# EAGLE design M896X (EAGLE 6.6.0)
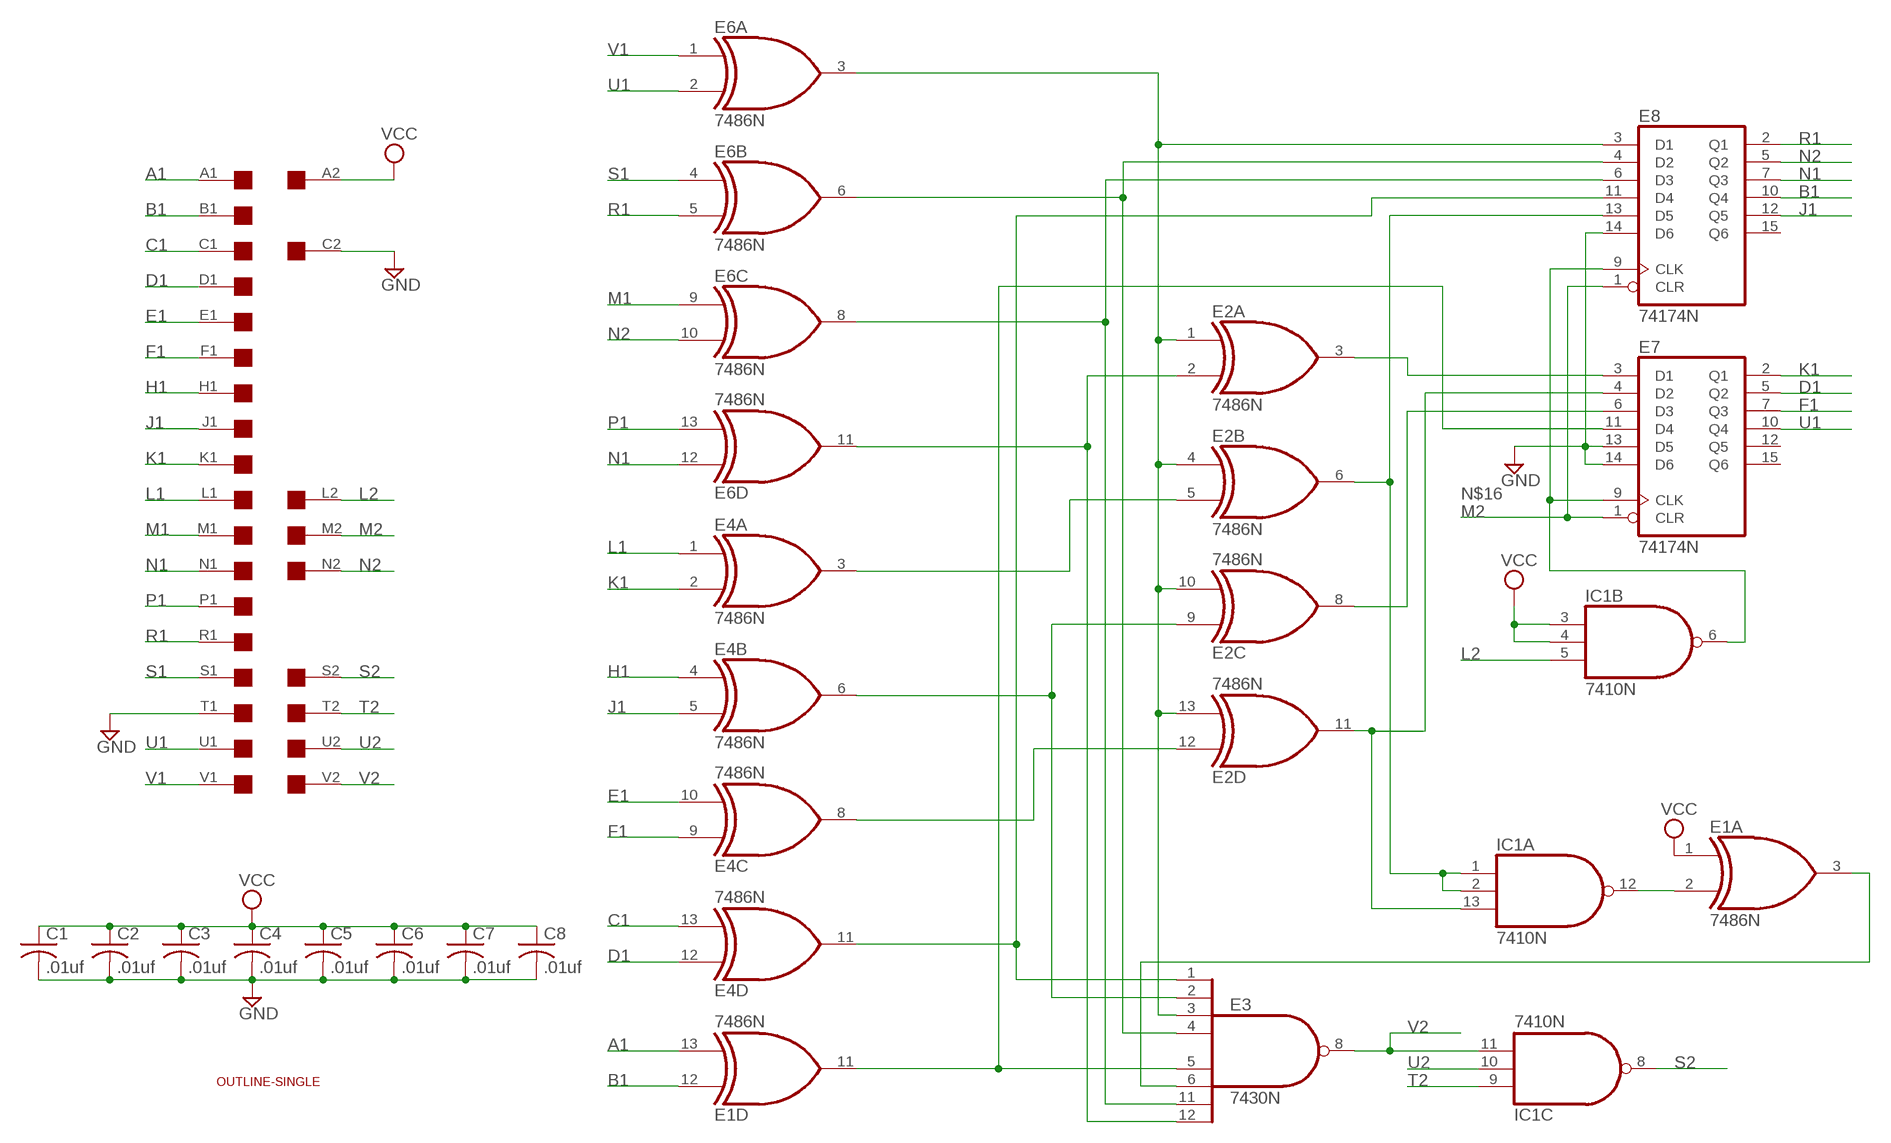
[diagram p0: schematic, sheet 1]

## Parts
C1  .01uf  C-US050-025X075  [C050-025X075]
C2  .01uf  C-US050-025X075  [C050-025X075]
C3  .01uf  C-US050-025X075  [C050-025X075]
C4  .01uf  C-US050-025X075  [C050-025X075]
C5  .01uf  C-US050-025X075  [C050-025X075]
C6  .01uf  C-US050-025X075  [C050-025X075]
C7  .01uf  C-US050-025X075  [C050-025X075]
C8  .01uf  C-US050-025X075  [C050-025X075]
E1  7486N  [DIL14]
E2  7486N  [DIL14]
E3  7430N  [DIL14]
E4  7486N  [DIL14]
E6  7486N  [DIL14]
E7  74174N  [DIL16]
E8  74174N  [DIL16]
IC1  7410N  [DIL14]
U$1  EDGE-2CONNECTOR  [EDGE-CON2]
U$4  OUTLINE-SINGLE  [SINGLE]

## Nets
A1: E1.13(D:I1) U$1.A1
B1: E1.12(D:I0) E8.10(Q4) U$1.B1
C1: E4.13(D:I1) U$1.C1
D1: E4.12(D:I0) E7.5(Q2) U$1.D1
E1: E4.10(C:I1) U$1.E1
F1: E4.9(C:I0) E7.7(Q3) U$1.F1
GND [power]: C1.2 C2.2 C3.2 C4.2 C5.2 C6.2 C7.2 C8.2 E7.13(D5) E7.14(D6) E8.14(D6) U$1.C2 U$1.T1
H1: E4.4(B:I0) U$1.H1
J1: E4.5(B:I1) E8.12(Q5) U$1.J1
K1: E4.2(A:I1) E7.2(Q1) U$1.K1
L1: E4.1(A:I0) U$1.L1
L2: IC1.5(B:I2) U$1.L2
M1: E6.9(C:I0) U$1.M1
M2: E7.1(CLR) E8.1(CLR) U$1.M2
N1: E6.12(D:I0) E8.7(Q3) U$1.N1
N2: E6.10(C:I1) E8.5(Q2) U$1.N2
N$1: E2.1(A:I0) E2.4(B:I0) E2.10(C:I1) E2.13(D:I1) E3.3(I2) E6.3(A:O) E8.3(D1)
N$2: E2.2(A:I1) E3.12(I7) E6.11(D:O)
N$3: E2.5(B:I1) E4.3(A:O)
N$4: E2.9(C:I0) E3.2(I1) E4.6(B:O)
N$5: E2.12(D:I0) E4.8(C:O)
N$6: E1.11(D:O) E3.5(I4) E7.11(D4)
N$7: E3.1(I0) E4.11(D:O) E8.11(D4)
N$8: E1.2(A:I1) IC1.12(A:O)
N$9: E3.11(I6) E6.8(C:O) E8.6(D3)
N$10: E3.4(I3) E6.6(B:O) E8.4(D2)
N$11: E1.3(A:O) E3.6(I5)
N$12: E2.6(B:O) E8.13(D5) IC1.1(A:I0) IC1.2(A:I1)
N$13: E2.11(D:O) E7.4(D2) IC1.13(A:I2)
N$14: E2.3(A:O) E7.3(D1)
N$15: E2.8(C:O) E7.6(D3)
N$16: E7.9(CLK) E8.9(CLK) IC1.6(B:O)
P1: E6.13(D:I1) U$1.P1
R1: E6.5(B:I1) E8.2(Q1) U$1.R1
S1: E6.4(B:I0) U$1.S1
S2: IC1.8(C:O) U$1.S2
T2: IC1.9(C:I0) U$1.T2
U1: E6.2(A:I1) E7.10(Q4) U$1.U1
U2: IC1.10(C:I1) U$1.U2
V1: E6.1(A:I0) U$1.V1
V2: E3.8(O) IC1.11(C:I2) U$1.V2
VCC [power]: C1.1 C2.1 C3.1 C4.1 C5.1 C6.1 C7.1 C8.1 E1.1(A:I0) IC1.3(B:I0) IC1.4(B:I1) U$1.A2
Unconnected: E1.4(B:I0) E1.5(B:I1) E1.6(B:O) E1.8(C:O) E1.9(C:I0) E1.10(C:I1) E7.12(Q5) E7.15(Q6) E8.15(Q6) U$1.B2 U$1.D2 U$1.E2 U$1.F2 U$1.H2 U$1.J2 U$1.K2 U$1.P2 U$1.R2

## Power pins joined to a net without a drawn wire
GND: E1.7(P:GND) E2.7(P:GND) E3.7(GND) E4.7(P:GND) E6.7(P:GND) E7.8(GND) E8.8(GND) IC1.7(P:GND)
VCC: E1.14(P:VCC) E2.14(P:VCC) E3.14(VCC) E4.14(P:VCC) E6.14(P:VCC) E7.16(VCC) E8.16(VCC) IC1.14(P:VCC)

## Library data of the parts
C1-C8 = rcl:C-US: CAPACITOR, American symbol
E1 E2 E4 E6 = 74xx-us:74*86: Quad 2-input EXCLUSIV-OR (XOR) gate
E3 = 74xx-us:74*30: 8-input NAND gate
E7 E8 = 74xx-us:74*174: Hex D type FLIP FLOP, clear
IC1 = 74xx-us:74*10: Triple 3-input NAND gate
U$1 = dec-con:EDGE-2: Double-Sided DEC edge connector.
U$4 = dec-con:OUTLINE-*: Board outlines for DEC boards.

## Net classes
1 power: width 0.508 mm

## Board
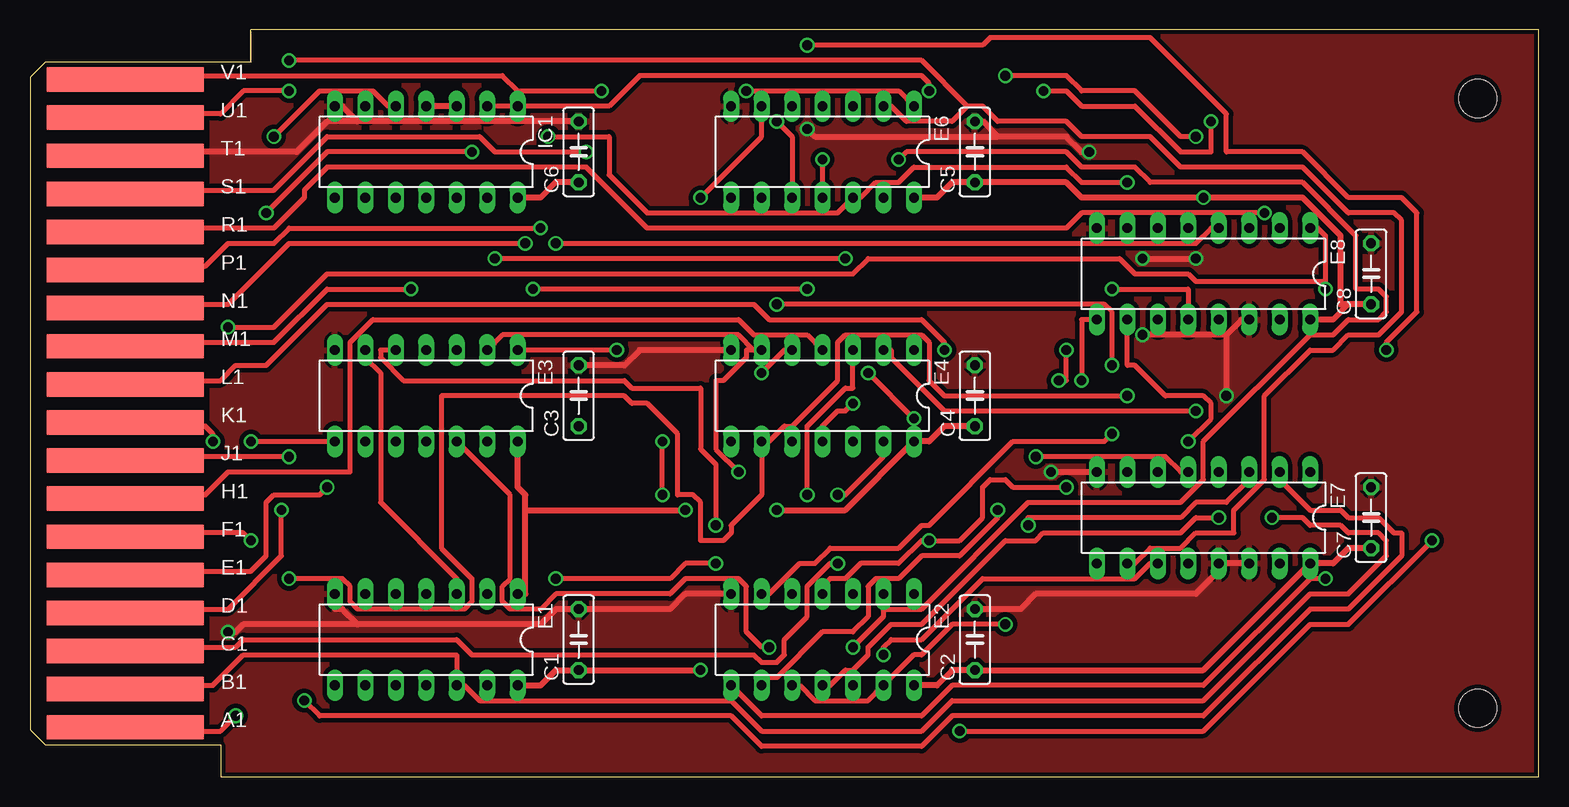
[diagram p1: board, top side]
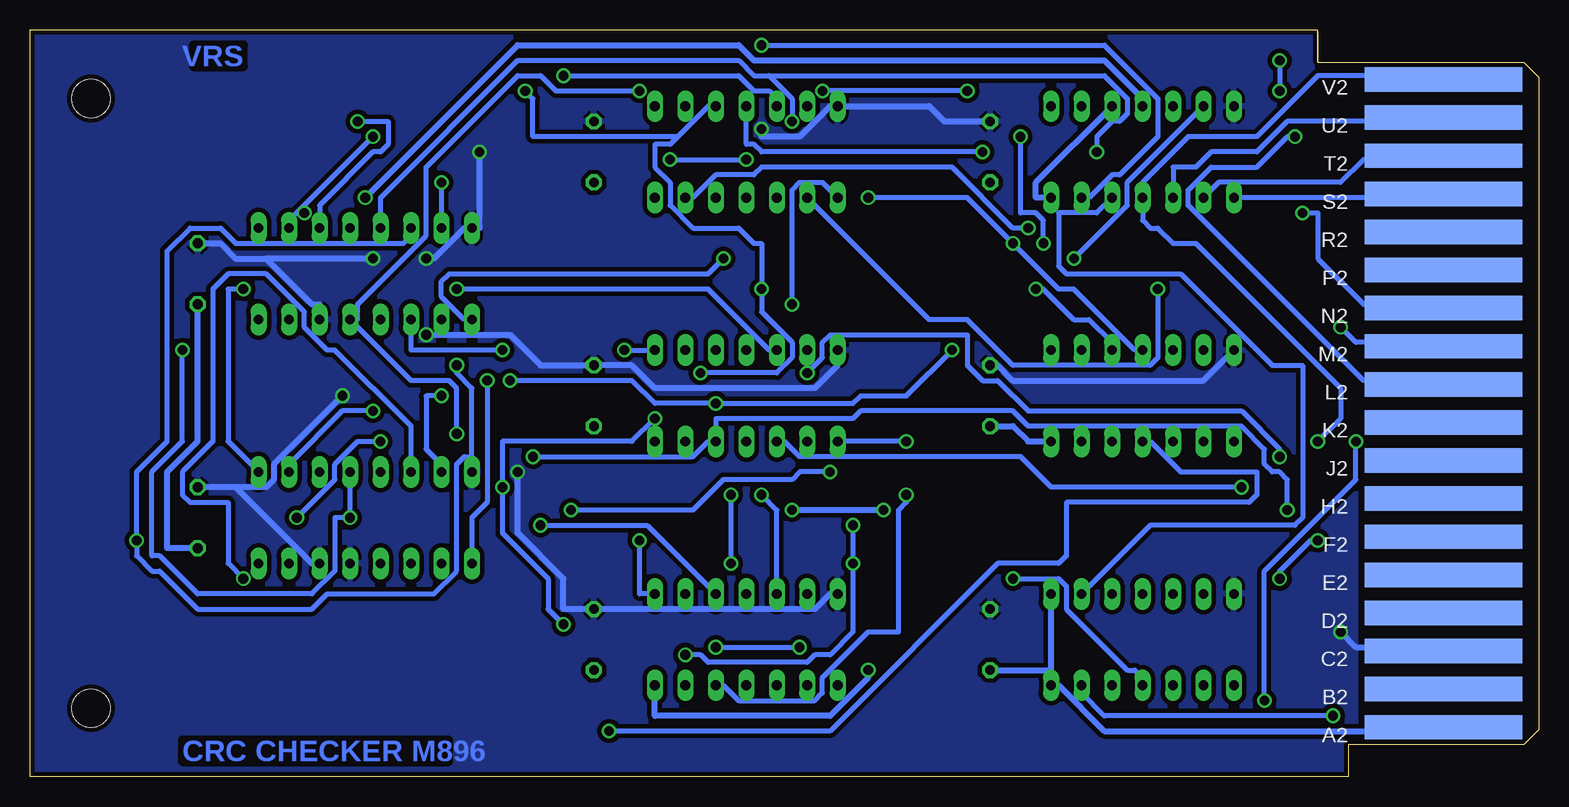
[diagram p2: board, bottom side, seen from below]

Size 125.73 x 62.23 mm. Coordinates in mm from the lower left corner, seen from the top.
Copper layers (1+16): Top 0.035mm / dielectric 1.5mm / Bottom 0.035mm
Design rules "16mils": minimum track width 16mil, minimum drill 32mil, track to track 15mil, track to pad 10mil, pad to pad 10mil, via to via 10mil, smd to smd 10mil, copper to edge 13mil, drill to drill 10mil, minimum pad ring 10mil, minimum via ring 8mil, stop-mask expansion 0mil, vias tented up to drill 0mil, thermal gap 10mil

### Footprints (pad centres in the part's own frame; a part is rotated, then mirrored left to right if it is on the bottom)
C050-025X075 = drill 0.813 octagon: 1 -2.54,0; 2 2.54,0
DIL14 = drill 0.813 long: 1 -7.62,-3.81; 2 -5.08,-3.81; 3 -2.54,-3.81; 4 0,-3.81; 5 2.54,-3.81; 6 5.08,-3.81; 7 7.62,-3.81; 8 7.62,3.81; 9 5.08,3.81; 10 2.54,3.81; 11 0,3.81; 12 -2.54,3.81; 13 -5.08,3.81; 14 -7.62,3.81
DIL16 = drill 0.813 long: 1 -8.89,-3.81; 2 -6.35,-3.81; 3 -3.81,-3.81; 4 -1.27,-3.81; 5 1.27,-3.81; 6 3.81,-3.81; 7 6.35,-3.81; 8 8.89,-3.81; 9 8.89,3.81; 10 6.35,3.81; 11 3.81,3.81; 12 1.27,3.81; 13 -1.27,3.81; 14 -3.81,3.81; 15 -6.35,3.81; 16 -8.89,3.81
EDGE-CON2 = smd 13.106 x 2.032: A1 7.938,4.128; B1 7.938,7.303; C1 7.938,10.477; D1 7.938,13.652; E1 7.938,16.828; F1 7.938,20.003; H1 7.938,23.177; J1 7.938,26.352; K1 7.938,29.527; L1 7.938,32.703; M1 7.938,35.877; N1 7.938,39.053; P1 7.938,42.227; R1 7.938,45.403; S1 7.938,48.578; T1 7.938,51.752; U1 7.938,54.928; V1 7.938,58.102 | smd 13.106 x 2.032 bottom: A2 7.938,4.128; B2 7.938,7.303; C2 7.938,10.477; D2 7.938,13.652; E2 7.938,16.828; F2 7.938,20.003; H2 7.938,23.177; J2 7.938,26.352; K2 7.938,29.527; L2 7.938,32.703; M2 7.938,35.877; N2 7.938,39.053; P2 7.938,42.227; R2 7.938,45.403; S2 7.938,48.578; T2 7.938,51.752; U2 7.938,54.928; V2 7.938,58.102
SINGLE = hole 3.175: 120.65,56.515; 120.65,5.715

### Placement (x,y rotation side)
C1  45.72,11.43 90 top
C2  78.74,11.43 90 top
C3  45.72,31.75 90 top
C4  78.74,31.75 90 top
C5  78.74,52.07 90 top
C6  45.72,52.07 90 top
C7  111.76,21.59 90 top
C8  111.76,41.91 90 top
E1  33.02,11.43 180 top
E2  66.04,11.43 180 top
E3  33.02,31.75 180 top
E4  66.04,31.75 180 top
E6  66.04,52.07 180 top
E7  97.79,21.59 180 top
E8  97.79,41.91 180 top
IC1  33.02,52.07 180 top
U$1  0,0 0 top
U$4  0,0 0 top

### Tracks (layer width: path | path; a pad name or v marks a point on that pad's centre or on a via)
A1  (via drill 0.81)
  Top 0.406: v17.15,5.08 15.88,3.81 8.26,3.81 U$1.A1
  Bottom 0.406: E1.13 38.1,6.99 36.2,5.08 v17.15,5.08
B1  (via drill 0.81)
  Top 0.406: U$1.B1 8.26,7.62 15.24,7.62 17.78,10.16 35.56,10.16 E1.12 36.2,7.62 37.47,6.35 58.42,6.35 60.96,3.81 74.3,3.81 76.84,6.35 97.79,6.35 106.68,15.24 109.86,15.24 113.03,18.41 113.03,19.68 112.4,20.32 109.86,20.32 109.22,20.95 106.68,20.95 106.05,21.59 v103.51,21.59 | E8.10 91.44,34.29 92.08,34.29 94.62,31.75 97.79,31.75 98.43,31.11 98.43,29.84 v96.52,27.94
  Bottom 0.406: v96.52,27.94 98.43,27.94 100.33,26.04 100.33,24.77 v103.51,21.59
C1  (via drill 0.81)
  Top 0.406: E4.13 71.12,26.67 67.95,23.5 v67.31,23.5 | v67.31,17.78 66.68,17.78 64.77,15.88 64.77,13.34 62.87,11.43 62.87,10.16 62.23,9.53 60.96,9.53 60.33,10.16 36.83,10.16 35.56,11.43 17.78,11.43 17.15,10.79 8.26,10.79 U$1.C1
  Bottom 0.406: v67.31,17.78 v67.31,23.5
D1  (via drill 0.81)
  Top 0.406: v83.82,26.67 94.62,26.67 95.89,25.4 E7.5 | v20.96,22.23 20.96,18.41 16.51,13.97 8.26,13.97 U$1.D1
  Bottom 0.406: v83.82,26.67 70.49,26.67 69.22,27.94 E4.12 68.58,29.84 57.15,29.84 56.52,30.48 43.82,30.48 42.55,29.21 24.77,29.21 22.86,27.3 22.86,26.04 22.23,25.4 21.59,25.4 20.96,24.77 v20.96,22.23
E1  (via drill 0.81)
  Top 0.406: v24.77,24.13 24.13,23.5 20.32,23.5 19.69,22.86 19.69,18.41 18.42,17.14 8.26,17.14 U$1.E1
  Bottom 0.406: E4.10 62.87,27.94 61.6,26.67 43.18,26.67 40.64,24.13 v24.77,24.13
F1  (via drill 0.81)
  Top 0.406: v91.44,31.75 76.2,31.75 74.93,33.02 74.93,36.2 74.3,36.83 67.95,36.83 67.31,36.2 67.31,33.02 63.5,29.21 62.87,29.21 61.6,27.94 E4.9 60.96,23.5 58.42,20.95 58.42,20.32 57.79,19.68 55.88,19.68 55.88,22.86 55.25,23.5 53.98,23.5 53.98,28.57 51.44,31.11 50.17,31.11 49.53,31.75 34.29,31.75 34.29,19.05 36.83,16.51 36.83,14.61 36.2,13.97 27.31,13.97 26.67,14.61 26.67,15.88 26.04,16.51 v21.59,16.51 | v18.42,19.68 17.78,20.32 8.26,20.32 U$1.F1
  Bottom 0.406: E7.7 91.44,26.04 92.71,27.3 92.71,31.75 v91.44,31.75 | v18.42,19.68 19.05,19.68 21.59,17.14 v21.59,16.51
GND  (via drill 0.81)
  Top 0.508: C2.2 82.55,13.97 83.82,15.24 97.16,15.24 99.7,17.78 | E7.14 99.7,17.78 | 99.7,17.78 E7.13 | v85.09,25.4 E7.8 | E2.7 54.61,15.24 53.34,13.97 C1.2 43.82,13.97 42.55,12.7 27.31,12.7 | E1.7 25.4,13.97 26.04,13.97 27.31,12.7 | v16.51,12.06 17.15,12.06 17.78,12.7 27.31,12.7 | C3.2 49.53,34.29 50.8,35.56 E4.7 | C5.2 79.38,54.61 80.65,53.34 | 80.65,53.34 86.36,53.34 87.63,52.07 v88.27,52.07 | v92.71,43.18 v97.16,43.18 | IC1.7 26.04,55.88 27.31,54.61 | C6.2 27.31,54.61 | 27.31,54.61 24.77,54.61 22.23,52.07 8.26,52.07 U$1.T1 | 80.65,53.34 65.41,53.34 v64.77,53.98 | 99.7,36.83 v92.71,36.83 | 99.7,36.83 100.97,38.1 E8.14 | 99.7,36.83 v99.7,31.75
  Bottom 0.508: v85.09,25.4 85.09,20.32 81.28,16.51 81.28,13.97 C2.2 60.33,13.97 59.06,15.24 E2.7 | 108.59,24.13 C7.2 | 108.59,24.13 102.24,17.78 E7.14 | v16.51,12.06 15.24,10.79 8.26,10.79 U$1.C2 | E3.7 27.94,33.02 43.82,33.02 45.09,34.29 C3.2 | E4.7 58.42,34.29 60.33,32.38 73.66,32.38 75.57,34.29 C4.2 83.19,34.29 85.73,36.83 v92.71,36.83 | E8.14 101.6,39.37 102.24,39.37 106.05,43.18 | 106.05,43.18 108.59,43.18 109.86,44.45 C8.2 | v88.27,52.07 88.27,45.72 E8.8 89.54,45.72 92.08,43.18 v92.71,43.18 | v97.16,43.18 106.05,43.18 | C6.2 49.53,54.61 50.8,55.88 E6.7 59.06,55.88 61.6,53.34 64.77,53.34 v64.77,53.98 | 108.59,24.13 106.05,24.13 105.41,24.77 105.41,26.04 v99.7,31.75
  pour Top (isolate 0.381): 15.24,62.23 125.73,62.23 125.73,0 15.24,0
  pour Bottom (isolate 0.381): 15.24,62.23 125.73,62.23 125.73,0 15.24,0
H1
  Top 0.406: E4.4 64.77,36.83 60.33,36.83 59.06,38.1 28.58,38.1 26.67,36.2 26.67,25.4 16.51,25.4 14.61,23.5 8.26,23.5 U$1.H1
J1  (via drill 0.81)
  Top 0.406: E8.12 96.52,40.64 v90.17,40.64 | v21.59,26.67 8.26,26.67 U$1.J1 | v60.96,33.66 62.87,35.56 E4.5
  Bottom 0.406: v90.17,40.64 69.22,40.64 64.14,35.56 E4.5 | v21.59,26.67 21.59,27.3 24.77,30.48 42.55,30.48 45.09,33.02 46.36,33.02 47.63,34.29 47.63,36.83 59.06,36.83 59.69,36.2 59.69,34.92 v60.96,33.66
K1  (via drill 0.81)
  Top 0.406: v97.16,30.48 76.2,30.48 71.76,34.92 71.76,35.56 E4.2 | v15.24,27.94 15.24,28.57 14.61,29.21 8.26,29.21 U$1.K1 | v22.86,6.35 24.13,5.08 58.42,5.08 60.96,2.54 74.3,2.54 76.84,5.08 97.79,5.08 106.68,13.97 109.86,13.97 114.3,18.41 114.3,20.32 113.67,20.32 112.4,21.59 109.86,21.59 109.22,22.23 106.68,22.23 104.14,24.77 E7.2
  Bottom 0.406: E7.2 104.14,26.04 99.7,30.48 v97.16,30.48 | v15.24,27.94 15.24,24.77 22.86,17.14 v22.86,6.35
L1  (via drill 0.81)
  Top 0.406: v76.2,35.56 76.2,36.2 74.3,38.1 61.6,38.1 60.33,39.37 24.77,39.37 19.69,34.29 17.15,34.29 15.88,33.02 8.26,33.02 U$1.L1
  Bottom 0.406: v76.2,35.56 E4.1
L2  (via drill 0.81)
  Top 0.406: IC1.5 29.85,55.88 28.58,57.15 24.13,57.15 v20.32,53.34
  Bottom 0.406: v20.32,53.34 20.96,53.34 23.5,50.8 27.31,50.8 29.21,48.9 29.21,47.62 14.61,33.02 8.26,33.02 U$1.L2
M1  (via drill 0.81)
  Top 0.406: v31.75,40.64 24.77,40.64 20.32,36.2 8.26,36.2 U$1.M1
  Bottom 0.406: E6.9 50.8,38.1 47.63,38.1 43.82,34.29 32.39,34.29 31.75,34.92 v31.75,40.64
M2  (via drill 0.81)
  Top 0.406: 107.95,41.27 107.95,45.09 107.32,45.72 E8.1 | 107.95,41.27 v107.95,40.64 | 107.95,41.27 97.16,41.27 96.52,41.91 92.08,41.91 90.81,43.18 69.85,43.18 68.58,41.91 24.77,41.91 20.32,37.47 v16.51,37.47
  Bottom 0.406: E7.1 109.22,27.94 109.22,40.64 v107.95,40.64 | v16.51,37.47 15.24,36.2 8.26,36.2 U$1.M2
N1  (via drill 0.81)
  Top 0.406: v91.44,49.53 87.63,49.53 86.36,50.8 73.66,50.8 72.39,49.53 70.49,49.53 69.22,48.26 E6.12 67.31,46.99 51.44,46.99 48.26,50.16 48.26,53.34 v43.18,53.34 | v41.28,44.45 21.59,44.45 16.51,39.37 8.26,39.37 U$1.N1
  Bottom 0.406: v91.44,49.53 E8.7 | v43.18,53.34 43.18,46.99 41.91,46.99 41.28,46.35 v41.28,44.45
N2  (via drill 0.81)
  Top 0.406: E6.10 63.5,53.34 v62.23,54.61 | v19.69,46.99 24.77,52.07 v36.83,52.07
  Bottom 0.406: v62.23,54.61 62.23,56.52 64.14,58.42 | 64.14,58.42 65.41,58.42 66.68,59.69 85.09,59.69 96.52,48.26 E8.5 | v19.69,46.99 18.42,46.99 18.42,43.18 14.61,39.37 8.26,39.37 U$1.N2 | v36.83,52.07 36.83,53.34 35.56,54.61 34.93,54.61 34.29,55.24 34.29,56.52 36.2,58.42 64.14,58.42
N$1  (via drill 0.81)
  Top 0.406: E2.10 64.14,7.62 65.41,6.35 69.85,6.35 E2.13 73.66,10.16 74.3,10.16 76.84,12.7 v81.28,12.7 | E2.4 66.04,15.88 66.68,16.51 67.95,16.51 69.22,17.78 72.39,17.78 74.3,19.68 v74.93,19.68 77.47,19.68 79.38,21.59 79.38,24.13 80.01,24.77 81.28,24.77 81.92,24.13 v86.36,24.13 | v64.77,40.64 v41.91,40.64 | v98.43,54.61 98.43,52.07 95.89,52.07 92.08,55.88 87.63,55.88 86.36,57.15 v84.46,57.15 | v69.85,33.66 v73.66,29.84
  Bottom 0.406: v74.93,19.68 74.93,15.24 E2.1 | v81.28,12.7 82.55,13.97 82.55,16.51 86.36,20.32 v86.36,24.13 86.36,27.94 75.57,27.94 v73.66,29.84 | E3.3 35.56,36.2 37.47,38.1 38.74,38.1 41.28,40.64 v41.91,40.64 | 71.76,53.34 69.22,55.88 E6.3 | 71.76,53.34 72.39,52.7 73.66,52.7 73.66,50.8 72.39,49.53 72.39,47.62 70.49,45.72 66.68,45.72 65.41,44.45 64.77,44.45 v64.77,40.64 64.77,38.73 62.23,36.2 62.23,34.92 63.5,33.66 v69.85,33.66 | E8.3 101.6,47.62 97.16,52.07 96.52,52.07 95.89,52.7 95.89,54.61 v98.43,54.61 | v84.46,57.15 83.82,56.52 83.82,53.34 71.76,53.34
N$2  (via drill 0.81)
  Top 0.406: E3.12 40.01,23.5 40.01,16.51 39.37,15.88 39.37,14.61 40.01,13.97 42.55,13.97 43.82,15.24 53.34,15.24 54.61,16.51 59.06,16.51 59.69,15.88 59.69,12.06 60.96,10.79 v61.6,10.79 | v68.58,10.79 71.12,13.34 71.12,13.97 | E2.2 71.12,13.97 | v66.04,51.44 E6.11 | v72.39,51.44 73.03,52.07 86.36,52.07 87.63,50.8 92.08,50.8 93.35,49.53 106.05,49.53 110.49,45.09 110.49,40.64 112.4,40.64 113.03,40.01 113.03,38.73 112.4,38.1 109.86,38.1 108.59,36.83 106.68,36.83 97.79,27.94 97.79,24.77 95.89,22.86 83.19,22.86 74.3,13.97 71.12,13.97
  Bottom 0.406: v68.58,10.79 v61.6,10.79 | v72.39,51.44 v66.04,51.44
N$3  (via drill 0.81)
  Top 0.406: E4.3 68.58,32.38 67.95,32.38 64.77,29.21 v64.77,23.5
  Bottom 0.406: v64.77,23.5 63.5,22.23 E2.5
N$4  (via drill 0.81)
  Top 0.406: E3.2 39.37,36.83 59.06,36.83 60.33,35.56 | E2.9 60.96,8.26 62.23,8.26 66.04,12.06 68.58,12.06 69.85,13.34 69.85,15.88 70.49,16.51 72.39,16.51 74.3,18.41 77.47,18.41 80.65,21.59 v80.65,22.23 | v59.06,25.4 57.15,27.3 57.15,33.02 57.79,33.02 59.69,34.92 59.69,35.56 60.33,35.56 | 60.33,35.56 E4.6
  Bottom 0.406: v80.65,22.23 70.49,22.23 67.95,24.77 62.23,24.77 61.6,25.4 v59.06,25.4
N$5  (via drill 0.81)
  Top 0.406: v52.71,23.5 v52.71,27.94
  Bottom 0.406: v52.71,27.94 E4.8 | v52.71,23.5 52.71,22.86 53.34,22.23 53.34,12.06 55.88,12.06 59.69,8.26 59.69,6.99 60.33,6.35 66.68,6.35 67.95,7.62 E2.12
N$6  (via drill 0.81)
  Top 0.406: E7.11 93.35,17.78 92.08,16.51 79.38,16.51 74.3,11.43 71.76,11.43 71.12,10.79 v71.12,10.16 | v57.15,20.95 57.15,26.04 55.88,27.3 55.88,32.38 50.17,32.38 49.53,33.02 31.12,33.02 29.21,34.92 29.21,35.56 E3.5 | v43.82,16.51 53.34,16.51 54.61,17.78 v57.15,17.78
  Bottom 0.406: v71.12,10.16 69.85,10.16 69.22,9.53 60.96,9.53 60.33,10.16 59.06,10.16 57.15,12.06 v57.15,17.78 v57.15,20.95 | E1.11 33.02,8.26 33.66,8.89 34.29,8.89 39.37,13.97 39.37,15.88 40.01,16.51 v43.82,16.51
N$7  (via drill 0.81)
  Top 0.406: v48.9,35.56 E3.1 | v68.58,31.11 67.95,30.48 67.31,30.48 66.04,29.21 E4.11 | v86.36,35.56 86.36,33.02 v85.73,33.02
  Bottom 0.406: v48.9,35.56 52.71,31.75 56.52,31.75 57.15,31.11 v68.58,31.11 73.66,31.11 75.57,33.02 v85.73,33.02 | E8.11 93.98,35.56 v86.36,35.56
N$8
  Bottom 0.406: E1.2 32.39,20.95 20.32,20.95 19.69,21.59 19.69,34.29 22.23,34.29 29.85,41.91 39.37,41.91 40.01,42.55 40.01,46.99 36.83,46.99 IC1.12
N$9  (via drill 0.81)
  Top 0.406: v116.84,19.68 109.86,12.7 106.68,12.7 97.79,3.81 v77.47,3.81 | v62.23,39.37 89.54,39.37 90.17,38.73 v90.17,34.29
  Bottom 0.406: E8.6 93.98,45.09 94.62,44.45 108.59,44.45 109.86,45.72 112.4,45.72 114.3,43.81 114.3,27.94 116.84,25.4 v116.84,19.68 116.84,18.41 115.57,17.14 114.94,17.14 111.76,13.97 102.24,13.97 100.97,15.24 92.08,15.24 90.17,17.14 90.17,26.04 89.54,26.67 88.9,26.67 88.9,32.38 90.17,33.66 v90.17,34.29 | v77.47,3.81 59.06,3.81 45.09,17.78 40.01,17.78 39.37,18.41 39.37,22.86 24.13,22.86 23.5,23.5 23.5,25.4 29.85,25.4 32.39,27.94 E3.11 | E6.8 59.69,49.53 61.6,49.53 62.23,48.9 v62.23,39.37
N$10  (via drill 0.81)
  Top 0.406: E6.6 60.96,53.34 v55.88,48.26 | E8.4 98.43,45.72 97.16,44.45 v43.82,44.45
  Bottom 0.406: v55.88,48.26 47.63,48.26 v43.82,44.45 40.01,40.64 38.74,40.64 33.66,35.56 E3.4
N$11
  Top 0.406: E1.3 35.56,16.51 29.21,22.86 29.21,33.66 27.94,34.92 E3.6
N$12  (via drill 0.81)
  Top 0.406: IC1.2 IC1.1 48.26,55.88 50.8,58.42 74.3,58.42 74.93,57.78 v74.93,57.15 | v90.17,28.57 89.54,27.94 81.92,27.94 74.93,20.95 74.3,20.95 72.39,19.05 66.68,19.05 65.41,17.78 64.14,17.78 61.6,15.24 E2.6
  Bottom 0.406: v90.17,28.57 90.17,32.38 90.81,33.02 93.98,33.02 E8.13 98.43,38.1 98.43,39.37 92.71,45.09 92.71,50.8 85.09,58.42 83.19,58.42 81.92,57.15 v74.93,57.15
N$13  (via drill 0.81)
  Top 0.406: v99.06,21.59 97.16,21.59 95.89,20.32 84.46,20.32 83.82,19.68 81.28,19.68 74.3,12.7 71.76,12.7 69.85,10.79 69.85,10.16 68.58,8.89 67.95,8.89 66.68,7.62 E2.11 | v64.77,60.96 79.38,60.96 80.01,61.59 93.35,61.59 99.7,55.24 99.7,52.07 106.05,52.07 109.86,48.26 114.3,48.26 115.57,46.99 115.57,38.73 113.03,36.2 v113.03,35.56
  Bottom 0.406: E7.4 v99.06,21.59 100.33,21.59 100.33,17.14 102.24,15.24 111.76,15.24 114.94,18.41 115.57,18.41 115.57,25.4 113.03,27.94 v113.03,35.56 | IC1.13 37.47,48.26 35.56,50.16 34.93,50.16 31.75,53.34 31.75,56.52 36.2,60.96 v64.77,60.96
N$14  (via drill 0.81)
  Top 0.406: v83.19,20.95 83.19,21.59 95.89,21.59 97.16,22.86 99.7,22.86 101.6,24.77 E7.3
  Bottom 0.406: E2.3 74.3,20.95 v83.19,20.95
N$15  (via drill 0.81)
  Top 0.406: E2.8 60.96,5.08 74.3,5.08 76.84,7.62 97.79,7.62 106.68,16.51 v107.95,16.51
  Bottom 0.406: v107.95,16.51 109.22,17.78 109.22,22.86 112.4,22.86 113.03,23.5 113.03,25.4 110.49,27.94 110.49,40.64 109.22,41.91 106.05,41.91 102.87,38.73 102.87,37.47 100.97,35.56 100.33,35.56 93.98,29.21 E7.6
N$16  (via drill 0.81)
  Top 0.406: v87.63,33.02 87.63,38.1 E8.9 | v67.95,43.18 v38.74,43.18
  Bottom 0.406: E7.9 88.9,21.59 87.63,22.86 v87.63,33.02 | IC1.6 34.29,49.53 34.29,47.62 v38.74,43.18 | v67.95,43.18 69.22,41.91 90.81,41.91 91.44,41.27 91.44,40.01 89.54,38.1 E8.9
P1  (via drill 0.81)
  Top 0.406: v42.55,45.72 21.59,45.72 20.32,44.45 16.51,44.45 14.61,42.55 8.26,42.55 U$1.P1
  Bottom 0.406: E6.13 70.49,48.26 68.58,50.16 65.41,50.16 64.77,50.8 48.9,50.8 43.82,45.72 v42.55,45.72
R1  (via drill 0.81)
  Top 0.406: v81.28,58.42 86.36,58.42 87.63,57.15 92.08,57.15 95.89,53.34 v97.16,53.34 | v102.87,46.99 87.63,46.99 86.36,45.72 51.44,45.72 46.36,50.8 24.77,50.8 22.86,48.9 22.86,48.26 20.32,45.72 8.26,45.72 U$1.R1
  Bottom 0.406: E6.5 63.5,56.52 64.14,57.15 65.41,57.15 66.68,58.42 v81.28,58.42 | 103.51,46.99 104.14,46.35 E8.2 | 103.51,46.99 v97.16,53.34 | 103.51,46.99 v102.87,46.99
S1  (via drill 0.81)
  Top 0.406: v46.36,52.07 38.74,52.07 37.47,53.34 24.77,53.34 20.32,48.9 8.26,48.9 U$1.S1
  Bottom 0.406: E6.4 66.04,52.7 65.41,52.7 64.77,52.07 v46.36,52.07
S2
  Bottom 0.406: IC1.8 8.26,48.26 U$1.S2
T2
  Bottom 0.406: IC1.9 26.67,49.53 16.51,49.53 14.61,51.44 8.26,51.44 U$1.T2
U1  (via drill 0.81)
  Top 0.406: E6.2 71.76,55.88 73.03,54.61 76.84,54.61 78.11,55.88 | 78.11,55.88 79.38,55.88 80.65,54.61 86.36,54.61 87.63,53.34 93.35,53.34 95.89,50.8 106.05,50.8 109.86,46.99 113.67,46.99 114.3,46.35 114.3,38.73 112.4,36.83 109.86,36.83 108.59,35.56 106.68,35.56 102.87,31.75 102.87,24.77 100.33,22.23 100.33,20.32 97.16,20.32 95.89,19.05 93.35,19.05 92.08,17.78 E7.10 | v21.59,57.15 17.78,57.15 15.88,55.24 8.26,55.24 U$1.U1 | v21.59,59.69 74.3,59.69 78.11,55.88
  Bottom 0.406: v21.59,59.69 v21.59,57.15
U2
  Bottom 0.406: IC1.10 30.48,50.8 28.58,50.8 27.31,52.07 23.5,52.07 20.96,54.61 8.26,54.61 U$1.U2
V1  (via drill 0.81)
  Top 0.406: E6.1 72.39,57.15 v59.69,57.15 | v47.63,57.15 40.64,57.15 39.37,58.42 8.26,58.42 U$1.V1
  Bottom 0.406: v47.63,57.15 v59.69,57.15
V2  (via drill 0.81)
  Top 0.406: v18.42,27.94 E3.8
  Bottom 0.406: U$1.V2 8.26,58.42 18.42,58.42 23.5,53.34 29.21,53.34 33.02,49.53 IC1.11 33.02,46.35 32.39,45.72 31.75,45.72 30.48,44.45 28.58,44.45 16.51,32.38 16.51,29.84 v18.42,27.94
VCC  (via drill 0.81)
  Top 0.508: IC1.3 IC1.4 | IC1.14 42.55,48.26 43.82,49.53 C6.1 | E6.14 75.57,48.26 76.84,49.53 C5.1 86.36,49.53 87.63,48.26 v97.79,48.26 106.05,48.26 109.22,45.09 109.22,39.37 109.86,39.37 | E8.16 108.59,38.1 109.86,39.37 | C8.1 109.86,39.37 | C7.1 109.86,19.05 108.59,17.78 E7.16 97.79,8.89 C2.1 76.84,8.89 75.57,7.62 E2.14 | C4.1 76.2,29.21 74.93,27.94 E4.14 67.95,22.23 v62.23,22.23 | E1.14 42.55,7.62 43.82,8.89 C1.1 v55.88,8.89 | E3.14 40.64,24.13 41.28,23.5 41.28,22.23 | 41.28,22.23 41.28,15.24 E1.1 | 41.28,22.23 v54.61,22.23
  Bottom 0.508: IC1.3 41.91,49.53 41.91,48.26 IC1.14 | IC1.4 33.02,56.52 36.2,59.69 65.41,59.69 66.68,60.96 85.09,60.96 v97.79,48.26 | E3.14 42.55,27.94 43.82,29.21 C3.1 | E1.1 40.64,8.89 C1.1 | E2.14 73.66,5.08 59.06,5.08 55.88,8.26 v55.88,8.89 | v54.61,22.23 v62.23,22.23 | E1.14 40.01,7.62 36.2,3.81 8.26,3.81 U$1.A2 | C8.1 111.76,27.94 114.3,25.4 114.3,19.05 C7.1

### Text on the board
Bottom: VRS | CRC CHECKER M896